# EAGLE design CNC Recorder Schematic (EAGLE 9.6.2)
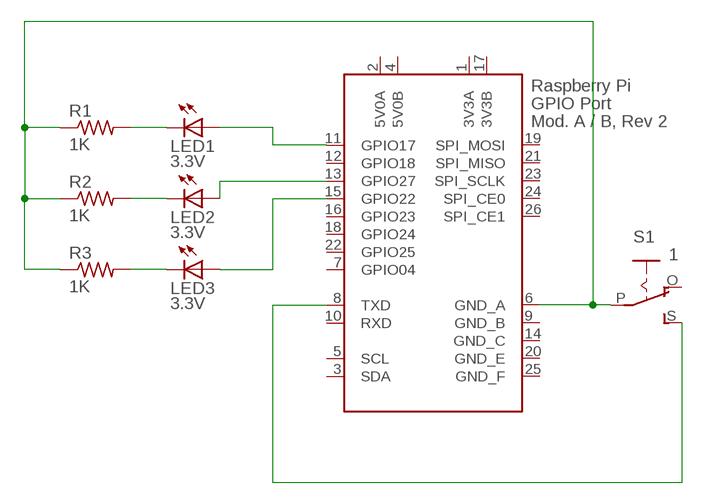
[diagram p0: schematic, sheet 1]

## Parts
LED1  3.3V  LED5MM  [LED5MM]
LED2  3.3V  LED5MM  [LED5MM]
LED3  3.3V  LED5MM  [LED5MM]
R1  1K  R-US_0207/10  [0207/10]
R2  1K  R-US_0207/10  [0207/10]
R3  1K  R-US_0207/10  [0207/10]
S1  1  EG1218S  [EG1218]
X1  RASPI_GPIO_AB#_PIN  [RASPI_GPIO_AB_PIN]

## Nets
N$1: LED1.A X1.11(GPIO17)
N$2: S1.S X1.8(TXD)
N$4: LED2.A X1.13(GPIO27)
N$5: LED3.A X1.15(GPIO22)
N$6: LED1.K(C) R1.2
N$7: LED2.K(C) R2.2
N$8: LED3.K(C) R3.2
N$9: R1.1 R2.1 R3.1 S1.P X1.6(GND_A)
Unconnected: S1.O X1.3(SDA) X1.5(SCL) X1.7(GPIO04) X1.10(RXD) X1.12(GPIO18) X1.16(GPIO23) X1.18(GPIO24) X1.19(SPI_MOSI) X1.21(SPI_MISO) X1.22(GPIO25) X1.23(SPI_SCLK) X1.24(SPI_CE0) X1.26(SPI_CE1)

## Power pins joined to a net without a drawn wire
3V3A: X1.1(3V3A)
3V3B: X1.17(3V3B)
5V0A: X1.2(5V0A)
5V0B: X1.4(5V0B)
GND_B: X1.9(GND_B)
GND_C: X1.14(GND_C)
GND_E: X1.20(GND_E)
GND_F: X1.25(GND_F)

## Library data of the parts
LED1-LED3 = adafruit:LED: LED OSRAM: - CHIPLED LG R971, LG N971, LY N971, LG Q971, LY Q971, LO R971, LY R971 LH N974, LH R974 LS Q976, LO Q976, LY Q976 LO Q996 - Hyper CHIPLED LW Q18S LB Q993, LB Q99A, LB R99A - SideLED LS A670, LO A670, LY A670, LG A670, LP A670 LB A673, LV A673, LT A673, LW A673 LH A674 LY A675 LS A676, LA A676, LO A676, LY A676, LW A676 LS A679, LY A679, LG A679 - Hyper Micro SIDELED® LS Y876, LA Y876, LO Y876, LY Y876 LT Y87S - SmartLED LW L88C, LW L88S LB L89C, LB L89S, LG L890 LS L89K, LO L89K, LY L89K LS L896, LA L896, LO L896, LY L896 - TOPLED LS T670, LO T670, LY T670, LG T670, LP T670 LSG T670, LSP T670, LSY T670, LOP T670, LYG T670 LG T671, LOG T671, LSG T671 LB T673, LV T673, LT T673, LW T673 LH T674 LS T676, LA T676, LO T676, LY T676, LB T676, LH T676, LSB T676, LW T676 LB T67C, LV T67C, LT T67C, LS T67K, LO T67K, LY T67K, LW E67C LS E67B, LA E67B, LO E67B, LY E67B, LB E67C, LV E67C, LT E67C LW T67C LS T679, LY T679, LG T679 LS T770, LO T770, LY T770, LG T770, LP T770 LB T773, LV T773, LT T773, LW T773 LH T774 LS E675, LA E675, LY E675, LS T675 LS T776, LA T776, LO T776, LY T776, LB T776 LHGB T686 LT T68C, LB T68C - Hyper Mini TOPLED® LB M676 - Mini TOPLED Santana® LG M470 LS M47K, LO M47K, LY M47K Source: http://www.osram.convergy.de/
R1-R3 = adafruit:R-US_: RESISTOR, American symbol
S1 = adafruit:EG1218: SLIDING SWITCH 0.1" spacing through hole, vertical SPDT slide switch http://www.ladyada.net/library/pcb/eaglelibrary.html
X1 = raspberrypi_bastelstube_v13:RASPI_GPIO_AB#: 2x13 header connector, all pins connected

## Board
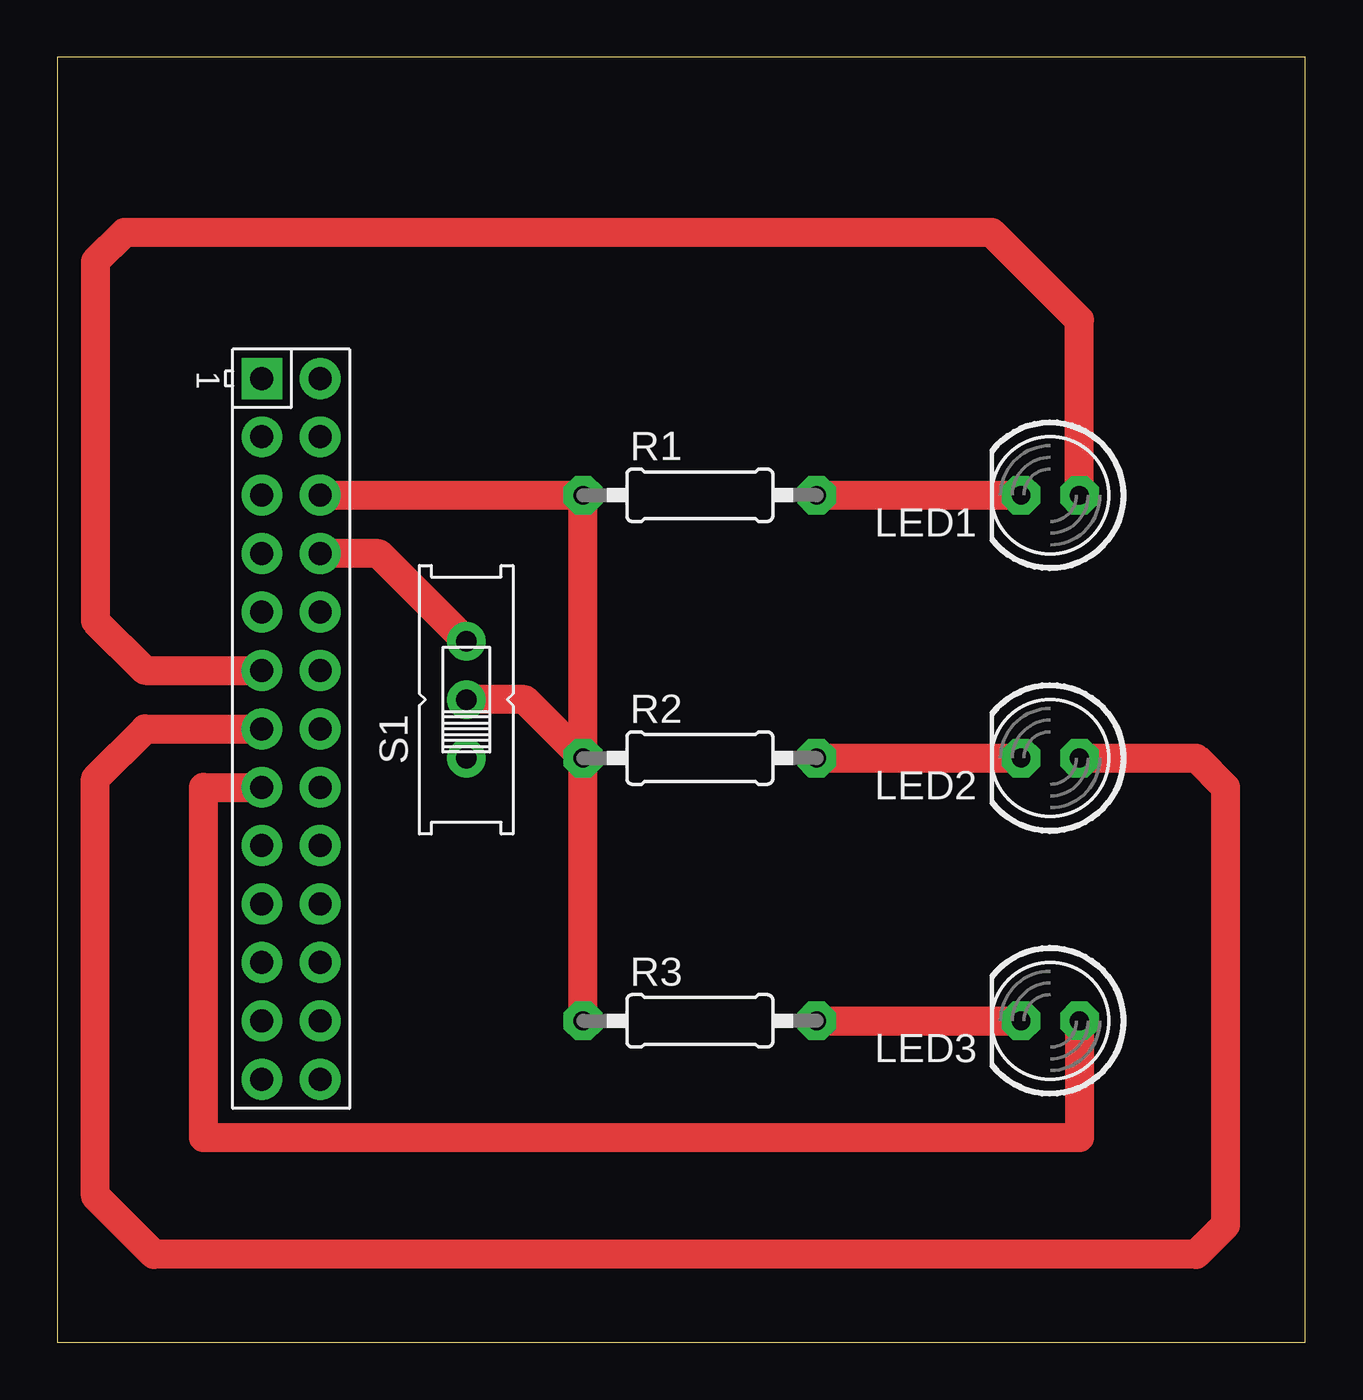
[diagram p1: board, top side]

Size 54.28 x 55.87 mm. Coordinates in mm from the lower left corner, seen from the top.
Outline: 0,0 54.28,0 54.28,55.87 0,55.87 0,0
Copper layers (1*16): Top 0.035mm / dielectric 1.5mm / Bottom 0.035mm
Design rules "default": minimum track width 6mil, minimum drill 0.35mm, track to track 6mil, track to pad 6mil, pad to pad 6mil, via to via 6mil, smd to smd 6mil, copper to edge 40mil, drill to drill 6mil, minimum pad ring 10mil, minimum via ring 8mil, stop-mask expansion 4mil, vias tented up to drill 0mil, thermal gap 10mil

### Footprints (pad centres in the part's own frame; a part is rotated, then mirrored left to right if it is on the bottom)
LED5MM = drill 0.813 pad 1.676 octagon: A -1.27,0; K 1.27,0
0207/10 = drill 0.813 pad 1.676 octagon: 1 -5.08,0; 2 5.08,0
EG1218 = drill 0.9 pad 1.676: O -2.54,0; P 0,0; S 2.54,0
RASPI_GPIO_AB_PIN = drill 1 pad 1.778 square: 1 -15.24,-1.27 | drill 1 pad 1.778: 2 -15.24,1.27; 3 -12.7,-1.27; 4 -12.7,1.27; 5 -10.16,-1.27; 6 -10.16,1.27; 7 -7.62,-1.27; 8 -7.62,1.27; 9 -5.08,-1.27; 10 -5.08,1.27; 11 -2.54,-1.27; 12 -2.54,1.27; 13 0,-1.27; 14 0,1.27; 15 2.54,-1.27; 16 2.54,1.27; 17 5.08,-1.27; 18 5.08,1.27; 19 7.62,-1.27; 20 7.62,1.27; 21 10.16,-1.27; 22 10.16,1.27; 23 12.7,-1.27; 24 12.7,1.27; 25 15.24,-1.27; 26 15.24,1.27

### Placement (x,y rotation side)
LED1  43.18,36.83 180 top
LED2  43.18,25.4 180 top
LED3  43.18,13.97 180 top
R1  27.94,36.83 0 top
R2  27.94,25.4 0 top
R3  27.94,13.97 0 top
S1  17.78,27.94 90 top
X1  10.16,26.67 270 top

### Tracks (layer width: path | path; a pad name or v marks a point on that pad's centre or on a via)
N$1
  Top 1.27: LED1.A 44.45,44.45 40.64,48.26 2.92,48.26 1.65,46.99 1.65,31.37 3.81,29.21 X1.11
N$2
  Top 1.27: S1.S 13.97,34.29 X1.8
N$4
  Top 1.27: X1.13 3.81,26.67 1.65,24.51 1.65,6.35 4.19,3.81 49.53,3.81 50.8,5.08 50.8,24.13 49.53,25.4 LED2.A
N$5
  Top 1.27: LED3.A 44.45,8.89 6.35,8.89 6.35,24.13 X1.15
N$6
  Top 1.27: R1.2 LED1.K
N$7
  Top 1.27: R2.2 LED2.K
N$8
  Top 1.27: R3.2 LED3.K
N$9
  Top 1.27: R3.1 R2.1 | R2.1 R1.1 X1.6 | R2.1 20.32,27.94 S1.P